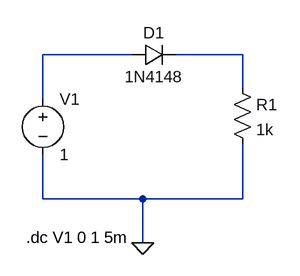
[diagram p0: schematic diode.asc]
diode.asc, the LTspice schematic file:
Version 4
SHEET 1 880 680
WIRE 208 48 80 48
WIRE 368 48 272 48
WIRE 368 96 368 48
WIRE 80 112 80 48
WIRE 80 256 80 192
WIRE 224 256 80 256
WIRE 368 256 368 176
WIRE 368 256 224 256
WIRE 224 320 224 256
FLAG 224 320 0
SYMBOL voltage 80 96 R0
WINDOW 123 0 0 Left 0
WINDOW 39 0 0 Left 0
SYMATTR InstName V1
SYMATTR Value 1
SYMBOL res 352 80 R0
SYMATTR InstName R1
SYMATTR Value 1k
SYMBOL diode 208 64 R270
WINDOW 0 32 32 VTop 2
WINDOW 3 0 32 VBottom 2
SYMATTR InstName D1
SYMATTR Value 1N4148
TEXT 56 312 Left 2 !.dc V1 0 1 5m

The netlist it stands for:
* diode.asc
V1 N001 0 1
R1 N002 0 1k
D1 N001 N002 1N4148
.model D D
.lib standard.dio
.dc V1 0 1 5m
.backanno
.end

* Results of the author's LTspice run, read from the files saved beside the schematic
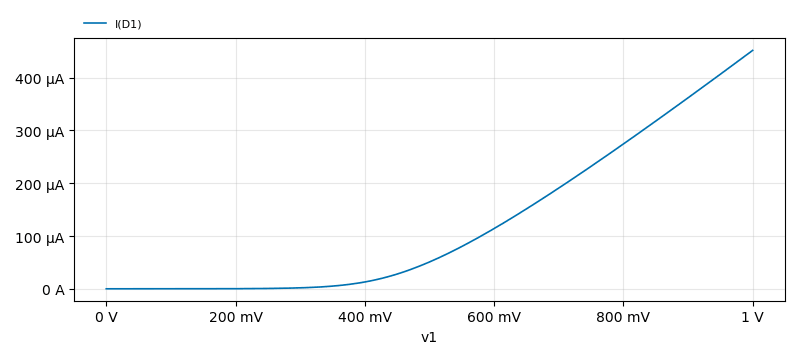
[diagram p1: DC transfer characteristic of diode.asc, plotted from the saved traces]
* DC transfer characteristic, 1 run:
*   I(D1): 0 A at v1=0 V, 451.6 µA at v1=1 V, min 0 A, max 451.6 µA